# EAGLE design hnb-switches (EAGLE 7.1.0)
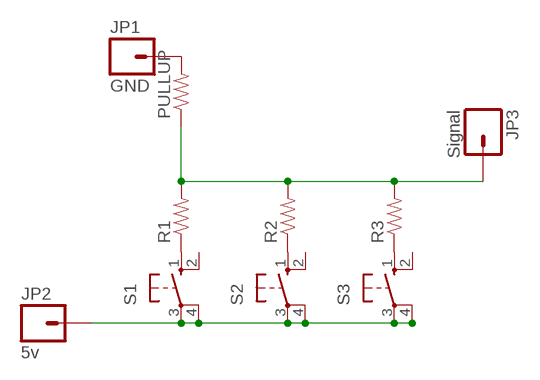
[diagram p0: schematic, sheet 1]

## Parts
JP1  GND  M01PTH_LONGPAD  [1X01_LONGPAD]
JP2  5v  M01PTH_LONGPAD  [1X01_LONGPAD]
JP3  Signal  M01PTH_LONGPAD  [1X01_LONGPAD]
PULLUP  RESISTOR1206  [1206]
R1  RESISTOR1206  [1206]
R2  RESISTOR1206  [1206]
R3  RESISTOR1206  [1206]
S1  10-XX  [B3F-10XX]
S2  10-XX  [B3F-10XX]
S3  10-XX  [B3F-10XX]

## Nets
N$1: JP1.1 PULLUP.2
N$2: R1.1 S1.1(S)
N$3: R2.1 S2.1(S)
N$4: R3.1 S3.1(S)
N$5: JP3.1 PULLUP.1 R1.2 R2.2 R3.2
N$7: JP2.1 S1.3(P) S1.4(P1) S2.3(P) S2.4(P1) S3.3(P) S3.4(P1)
Unconnected: S1.2(S1) S2.2(S1) S3.2(S1)

## Library data of the parts
JP1-JP3 = SparkFun-Connectors:M01: Header 1 Standard 1-pin 0.1" header. Use with straight break away headers (SKU : PRT-00116), right angle break away headers (PRT-00553), swiss pins (PRT-00743), machine pins (PRT-00117), and female headers (PRT-00115).
PULLUP R1-R3 = SparkFun-Passives:RESISTOR: Resistor Basic schematic elements and footprints for 0603, 1206, and PTH resistors.
S1-S3 = switch-omron:10-XX: OMRON SWITCH; MPN: B3F-1000; OC_FARNELL: 176432; OC_NEWARK: 36M3542

## Board
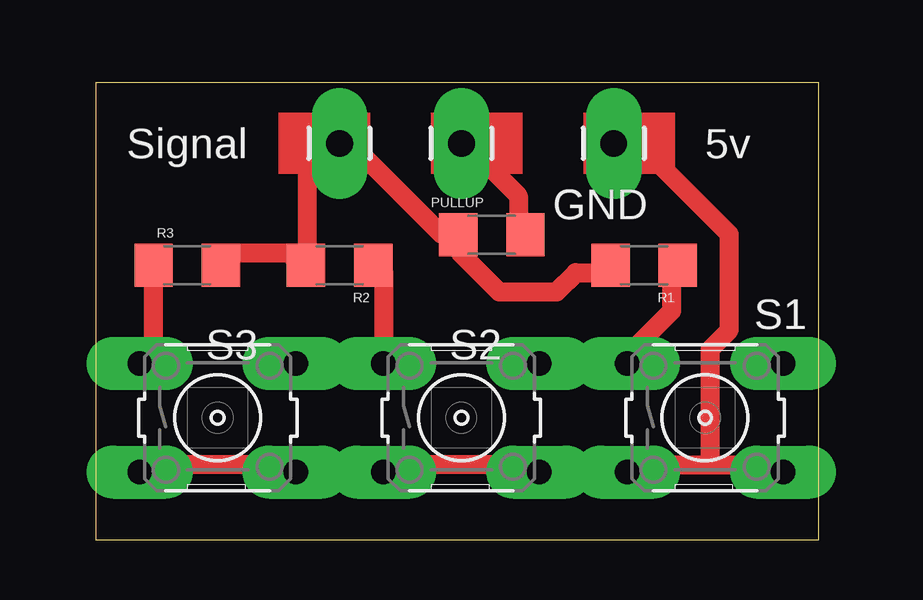
[diagram p1: board, top side]

Size 30.15 x 19.04 mm. Coordinates in mm from the lower left corner, seen from the top.
Outline: 0,0 30.15,0 30.15,19.04 0,19.04 0,0
Copper layers (1*16): Top 0.035mm / dielectric 1.5mm / Bottom 0.035mm
Design rules "make": minimum track width 0.8mm, minimum drill 0.8mm, track to track 0.8mm, track to pad 0.8mm, pad to pad 0.45mm, via to via 0.8mm, smd to smd 8mil, copper to edge 10mil, drill to drill 8mil, minimum pad ring 0.6mm, minimum via ring 0.6mm, stop-mask expansion 0mil, vias tented up to drill 0mil, thermal gap 10mil

### Footprints (pad centres in the part's own frame; a part is rotated, then mirrored left to right if it is on the bottom)
1X01_LONGPAD = drill 1.118 pad 1.88 long: 1 0,0
1206 = smd 1.6 x 1.8: 1 -1.4,0; 2 1.4,0
B3F-10XX = drill 1.016 long: 1 -3.251,2.261; 2 3.251,2.261; 3 -3.251,-2.261; 4 3.251,-2.261

### Placement (x,y rotation side)
JP1  15.24,16.51 0 top
JP2  21.59,16.51 0 top
JP3  10.16,16.51 0 top
PULLUP  16.51,12.7 0 top
R1  22.86,11.43 180 top
R2  10.16,11.43 180 top
R3  3.81,11.43 0 top
S1  25.4,5.08 0 top
S2  15.24,5.08 0 top
S3  5.08,5.08 0 top

### Tracks (layer width: path | path; a pad name or v marks a point on that pad's centre or on a via)
N$1
  Top 0.8: PULLUP.2 17.61,12.73 17.61,14.33 16.01,15.93 JP1.1
N$2
  Top 0.8: R1.1 24.01,11.13 24.01,9.53 22.41,7.93 S1.1
N$3
  Top 0.8: R2.1 12.01,11.13 12.01,7.93 S2.1
N$4
  Top 0.8: R3.1 2.41,7.93 S3.1
N$5
  Top 0.8: R3.2 5.61,11.93 8.01,11.93 R2.2 8.81,11.93 8.81,15.13 9.61,15.93 JP3.1 10.41,16.73 14.41,12.73 PULLUP.1 15.21,11.93 16.81,10.33 19.21,10.33 20.01,11.13 20.81,11.13 R1.2
N$7
  Top 0.8: S3.3 2.41,3.13 8.01,3.13 S3.4 8.81,3.13 11.21,3.13 S2.3 12.01,3.13 18.41,3.13 S2.4 19.21,3.13 21.61,3.13 S1.3 22.41,3.13 25.61,3.13 | 25.61,3.13 28.01,3.13 S1.4 | 25.61,3.13 25.61,7.93 26.41,8.73 26.41,12.73 23.21,15.93 20.81,15.93 JP2.1
(copper drawn outside any net)
  shapes: Top area x3